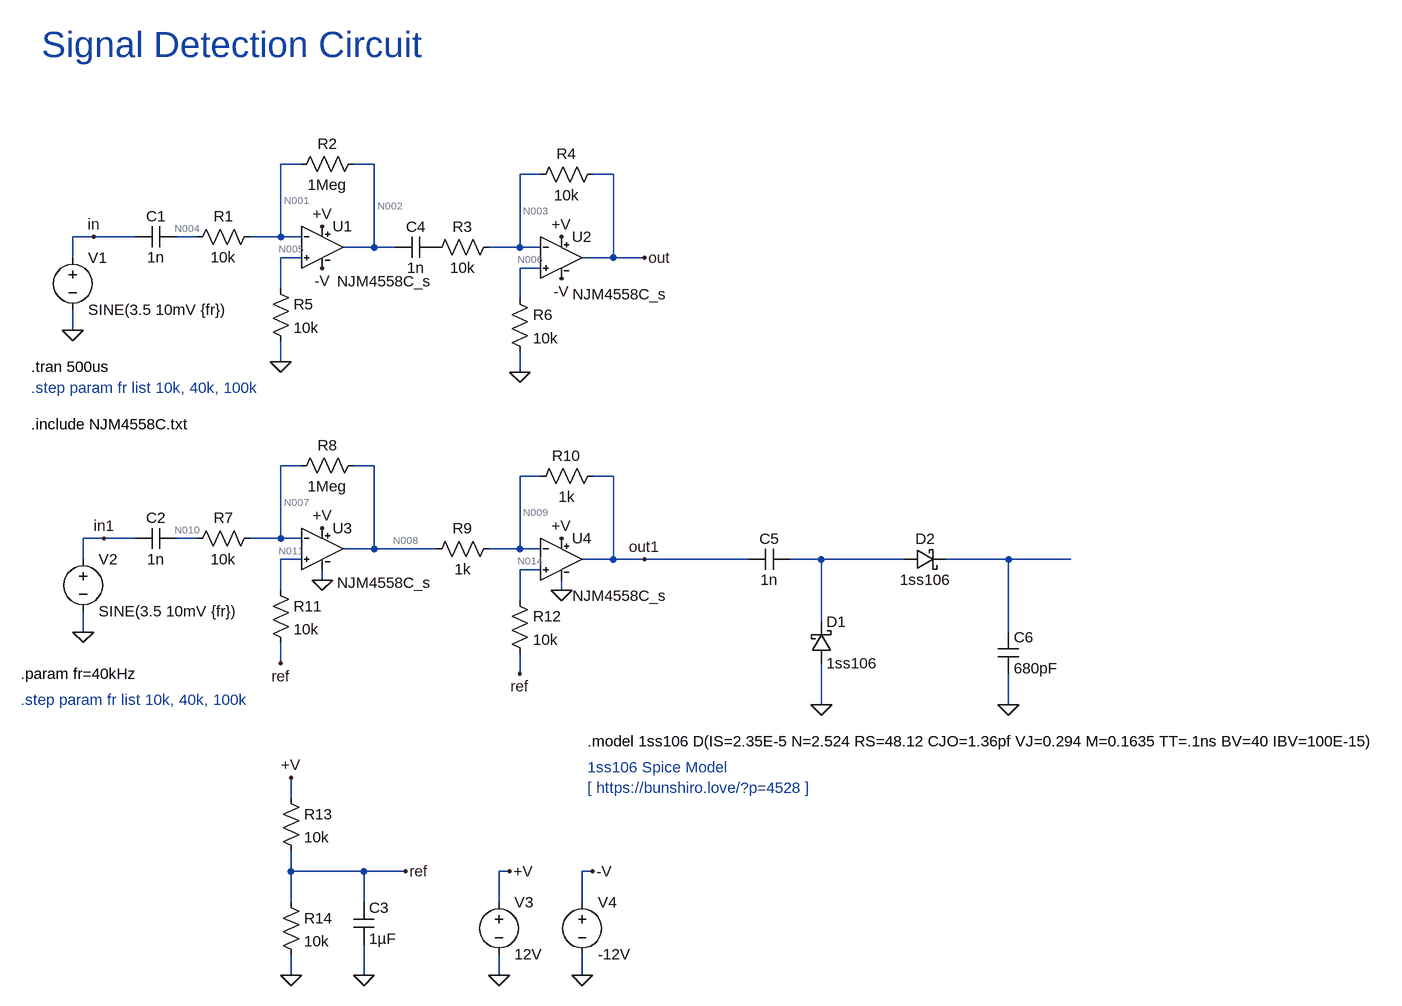
[diagram p0: schematic Sinal detection_njm4558C.asc]
Sinal detection_njm4558C.asc, the LTspice schematic file:
Version 4
SHEET 1 3464 900
WIRE 112 -368 80 -368
WIRE 224 -368 192 -368
WIRE 480 -352 448 -352
WIRE 592 -352 560 -352
WIRE -208 -256 -240 -256
WIRE -144 -256 -208 -256
WIRE -48 -256 -80 -256
WIRE 80 -256 80 -368
WIRE 80 -256 32 -256
WIRE 112 -256 80 -256
WIRE 224 -240 224 -368
WIRE 224 -240 176 -240
WIRE 256 -240 224 -240
WIRE 448 -240 448 -352
WIRE 448 -240 400 -240
WIRE 480 -240 448 -240
WIRE -240 -224 -240 -256
WIRE 112 -224 80 -224
WIRE 592 -224 592 -352
WIRE 592 -224 544 -224
WIRE 640 -224 592 -224
WIRE 480 -208 448 -208
WIRE 80 -176 80 -224
WIRE 448 -160 448 -208
WIRE -240 -112 -240 -144
WIRE 80 -64 80 -96
WIRE 448 -48 448 -80
WIRE 112 96 80 96
WIRE 224 96 192 96
WIRE 480 112 448 112
WIRE 592 112 560 112
WIRE -192 208 -224 208
WIRE -144 208 -192 208
WIRE -48 208 -80 208
WIRE 80 208 80 96
WIRE 80 208 32 208
WIRE 112 208 80 208
WIRE 224 224 224 96
WIRE 224 224 176 224
WIRE 320 224 224 224
WIRE 448 224 448 112
WIRE 448 224 400 224
WIRE 480 224 448 224
WIRE -224 240 -224 208
WIRE 112 240 80 240
WIRE 592 240 592 112
WIRE 592 240 544 240
WIRE 640 240 592 240
WIRE 800 240 640 240
WIRE 912 240 864 240
WIRE 1040 240 912 240
WIRE 1200 240 1104 240
WIRE 1296 240 1200 240
WIRE 480 256 448 256
WIRE 144 272 144 256
WIRE 80 288 80 240
WIRE 512 288 512 272
WIRE 448 304 448 256
WIRE 912 336 912 240
WIRE -224 352 -224 320
WIRE 1200 352 1200 240
WIRE 80 400 80 368
WIRE 448 416 448 384
WIRE 912 464 912 400
WIRE 1200 464 1200 416
WIRE 96 608 96 576
WIRE 96 720 96 688
WIRE 208 720 96 720
WIRE 272 720 208 720
WIRE 432 720 416 720
WIRE 560 720 544 720
WIRE 96 768 96 720
WIRE 208 768 208 720
WIRE 416 768 416 720
WIRE 544 768 544 720
WIRE 96 880 96 848
WIRE 208 880 208 832
WIRE 416 880 416 848
WIRE 544 880 544 848
FLAG -240 -112 0
FLAG 144 -272 +V
FLAG 144 -208 -V
FLAG 512 -256 +V
FLAG 512 -192 -V
FLAG 640 -224 out
FLAG -208 -256 in
FLAG 80 -64 0
FLAG 448 -48 0
FLAG -224 352 0
FLAG 144 192 +V
FLAG 512 208 +V
FLAG 640 240 out1
FLAG -192 208 in1
FLAG 80 400 ref
FLAG 448 416 ref
FLAG 144 272 0
FLAG 512 288 0
FLAG 416 880 0
FLAG 432 720 +V
FLAG 544 880 0
FLAG 560 720 -V
FLAG 96 880 0
FLAG 96 576 +V
FLAG 208 880 0
FLAG 272 720 ref
FLAG 912 464 0
FLAG 1200 464 0
SYMBOL NJM4558C 144 -304 R0
WINDOW 3 23 116 Left 2
SYMATTR Value NJM4558C_s
SYMATTR InstName U1
SYMBOL res 48 -272 R90
WINDOW 0 0 56 VBottom 2
WINDOW 3 32 56 VTop 2
SYMATTR InstName R1
SYMATTR Value 10k
SYMBOL res 208 -384 R90
WINDOW 0 0 56 VBottom 2
WINDOW 3 32 56 VTop 2
SYMATTR InstName R2
SYMATTR Value 1Meg
SYMBOL voltage -240 -240 R0
WINDOW 123 0 0 Left 0
WINDOW 39 0 0 Left 0
SYMATTR InstName V1
SYMATTR Value SINE(3.5 10mV {fr})
SYMBOL cap -80 -272 R90
WINDOW 0 0 32 VBottom 2
WINDOW 3 32 32 VTop 2
SYMATTR InstName C1
SYMATTR Value 1n
SYMBOL NJM4558C 512 -288 R0
WINDOW 3 17 120 Left 2
SYMATTR Value NJM4558C_s
SYMATTR InstName U2
SYMBOL res 416 -256 R90
WINDOW 0 0 56 VBottom 2
WINDOW 3 32 56 VTop 2
SYMATTR InstName R3
SYMATTR Value 10k
SYMBOL res 576 -368 R90
WINDOW 0 0 56 VBottom 2
WINDOW 3 32 56 VTop 2
SYMATTR InstName R4
SYMATTR Value 10k
SYMBOL res 64 -192 R0
SYMATTR InstName R5
SYMATTR Value 10k
SYMBOL res 432 -176 R0
SYMATTR InstName R6
SYMATTR Value 10k
SYMBOL NJM4558C 144 160 R0
WINDOW 3 23 116 Left 2
SYMATTR Value NJM4558C_s
SYMATTR InstName U3
SYMBOL res 48 192 R90
WINDOW 0 0 56 VBottom 2
WINDOW 3 32 56 VTop 2
SYMATTR InstName R7
SYMATTR Value 10k
SYMBOL res 208 80 R90
WINDOW 0 0 56 VBottom 2
WINDOW 3 32 56 VTop 2
SYMATTR InstName R8
SYMATTR Value 1Meg
SYMBOL voltage -224 224 R0
WINDOW 123 0 0 Left 0
WINDOW 39 0 0 Left 0
SYMATTR InstName V2
SYMATTR Value SINE(3.5 10mV {fr})
SYMBOL cap -80 192 R90
WINDOW 0 0 32 VBottom 2
WINDOW 3 32 32 VTop 2
SYMATTR InstName C2
SYMATTR Value 1n
SYMBOL NJM4558C 512 176 R0
WINDOW 3 17 120 Left 2
SYMATTR Value NJM4558C_s
SYMATTR InstName U4
SYMBOL res 416 208 R90
WINDOW 0 0 56 VBottom 2
WINDOW 3 32 56 VTop 2
SYMATTR InstName R9
SYMATTR Value 1k
SYMBOL res 576 96 R90
WINDOW 0 0 56 VBottom 2
WINDOW 3 32 56 VTop 2
SYMATTR InstName R10
SYMATTR Value 1k
SYMBOL res 64 272 R0
SYMATTR InstName R11
SYMATTR Value 10k
SYMBOL res 432 288 R0
SYMATTR InstName R12
SYMATTR Value 10k
SYMBOL voltage 416 752 R0
SYMATTR InstName V3
SYMATTR Value 12V
SYMBOL voltage 544 752 R0
SYMATTR InstName V4
SYMATTR Value -12V
SYMBOL res 80 592 R0
SYMATTR InstName R13
SYMATTR Value 10k
SYMBOL res 80 752 R0
SYMATTR InstName R14
SYMATTR Value 10k
SYMBOL cap 192 768 R0
SYMATTR InstName C3
SYMATTR Value 1µF
SYMBOL cap 320 -256 R90
WINDOW 0 0 32 VBottom 2
WINDOW 3 32 32 VTop 2
SYMATTR InstName C4
SYMATTR Value 1n
SYMBOL schottky 896 400 M180
WINDOW 0 24 64 Left 2
WINDOW 3 24 0 Left 2
SYMATTR InstName D1
SYMATTR Value 1ss106
SYMATTR Description Diode
SYMATTR Type diode
SYMBOL cap 864 224 R90
WINDOW 0 0 32 VBottom 2
WINDOW 3 32 32 VTop 2
SYMATTR InstName C5
SYMATTR Value 1n
SYMBOL schottky 1040 224 M90
WINDOW 0 0 32 VBottom 2
WINDOW 3 32 32 VTop 2
SYMATTR InstName D2
SYMATTR Value 1ss106
SYMATTR Description Diode
SYMATTR Type diode
SYMBOL cap 1184 352 R0
SYMATTR InstName C6
SYMATTR Value 680pF
TEXT -304 32 Left 2 !.include NJM4558C.txt
TEXT -304 -56 Left 2 !.tran 500us
TEXT -320 416 Left 2 !.param fr=40kHz
TEXT -320 456 Left 2 ;.step param fr list 10k, 40k, 100k
TEXT -304 -24 Left 2 ;.step param fr list 10k, 40k, 100k
TEXT -288 -552 Left 5 ;Signal Detection Circuit
TEXT 552 520 Left 2 !.model 1ss106 D(IS=2.35E-5 N=2.524 RS=48.12 CJO=1.36pf VJ=0.294 M=0.1635 TT=.1ns BV=40 IBV=100E-15)
TEXT 552 560 Left 2 ;1ss106 Spice Model\n[ https://bunshiro.love/?p=4528 ]

The netlist it stands for:
* Sinal detection_njm4558C.asc
XU1 N005 N001 +V -V N002 NJM4558C_s  ; pins In+ In- V+ V- OUT
R1 N001 N004 10k
R2 N002 N001 1Meg
V1 in 0 SINE(3.5 10mV {fr})
C1 N004 in 1n
XU2 N006 N003 +V -V out NJM4558C_s  ; pins In+ In- V+ V- OUT
R3 N003 P001 10k
R4 out N003 10k
R5 N005 0 10k
R6 N006 0 10k
XU3 N011 N007 +V 0 N008 NJM4558C_s  ; pins In+ In- V+ V- OUT
R7 N007 N010 10k
R8 N008 N007 1Meg
V2 in1 0 SINE(3.5 10mV {fr})
C2 N010 in1 1n
XU4 N014 N009 +V 0 out1 NJM4558C_s  ; pins In+ In- V+ V- OUT
R9 N009 N008 1k
R10 out1 N009 1k
R11 N011 ref 10k
R12 N014 ref 10k
V3 +V 0 12V
V4 -V 0 -12V
R13 +V ref 10k
R14 ref 0 10k
C3 ref 0 1µF
C4 P001 N002 1n
D1 0 N012 1ss106
C5 N012 out1 1n
D2 N012 N013 1ss106
C6 N013 0 680pF
.model D D
.lib standard.dio
.include NJM4558C.txt
.tran 500us
.param fr=40kHz
* .step param fr list 10k, 40k, 100k
* .step param fr list 10k, 40k, 100k
* Signal Detection Circuit
.model 1ss106 D(IS=2.35E-5 N=2.524 RS=48.12 CJO=1.36pf VJ=0.294 M=0.1635 TT=.1ns BV=40 IBV=100E-15)
* 1ss106 Spice Model
* [ https://bunshiro.love/?p=4528 ]
.backanno
.end

* Results of the author's LTspice run, read from the files saved beside the schematic
* Operating Point, zero values left out:
*   V(n002) = -27.67 mV
*   V(-v) = -12 V
*   V(+v) = 12 V
*   V(n001) = -275.7 µV
*   V(n005) = 224 µV
*   V(n004) = -275.7 µV
*   V(in) = 3.5 V
*   V(out) = -549.9 µV
*   V(n003) = -276 µV
*   V(n006) = 224 µV
*   V(p001) = -276 µV
*   V(n008) = 5.973 V
*   V(n007) = 6 V
*   V(n011) = 6 V
*   V(n010) = 6 V
*   V(in1) = 3.5 V
*   V(out1) = 6.027 V
*   V(n009) = 6 V
*   V(n014) = 6 V
*   V(ref) = 6 V
*   I(R2) = -27.39 nA
*   I(R4) = -27.4 nA
*   I(R5) = 22.4 nA
*   I(R6) = 22.4 nA
*   I(R8) = -27.4 nA
*   I(R9) = 27.4 µA
*   I(R10) = 27.37 µA
*   I(R11) = 22.41 nA
*   I(R12) = 22.41 nA
*   I(R13) = 600 µA
*   I(R14) = 600 µA
*   I(V3) = -47.71 mA
*   I(V4) = 30.36 mA
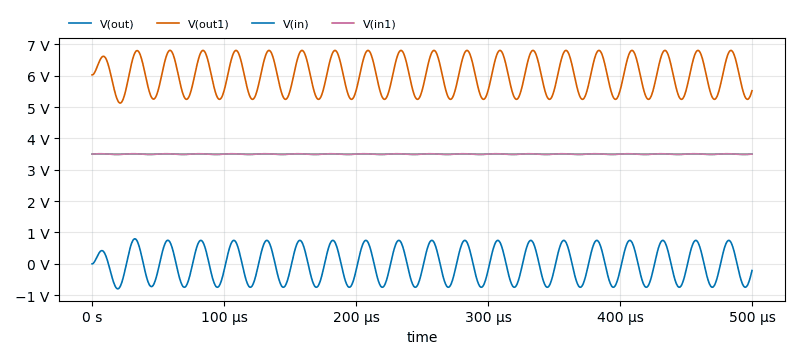
[diagram p1: Transient Analysis of Sinal detection_njm4558C.asc, plotted from the saved traces]
* Transient Analysis, 1 run:
*   V(out): min -797.7 mV, max 795.9 mV, average -6.265 mV, rms 525.9 mV, last -215.1 mV
*   V(out1): min 5.129 V, max 6.809 V, average 6.023 V, rms 6.048 V, last 5.521 V
*   V(in): min 3.49 V, max 3.51 V, average 3.5 V, rms 3.5 V, last 3.5 V
*   V(in1): min 3.49 V, max 3.51 V, average 3.5 V, rms 3.5 V, last 3.5 V